# Altium schematic sheet 6_MUX.SchDoc
size A4; DocumentNumber: 5; SheetNumber: 6; SheetTotal: 6
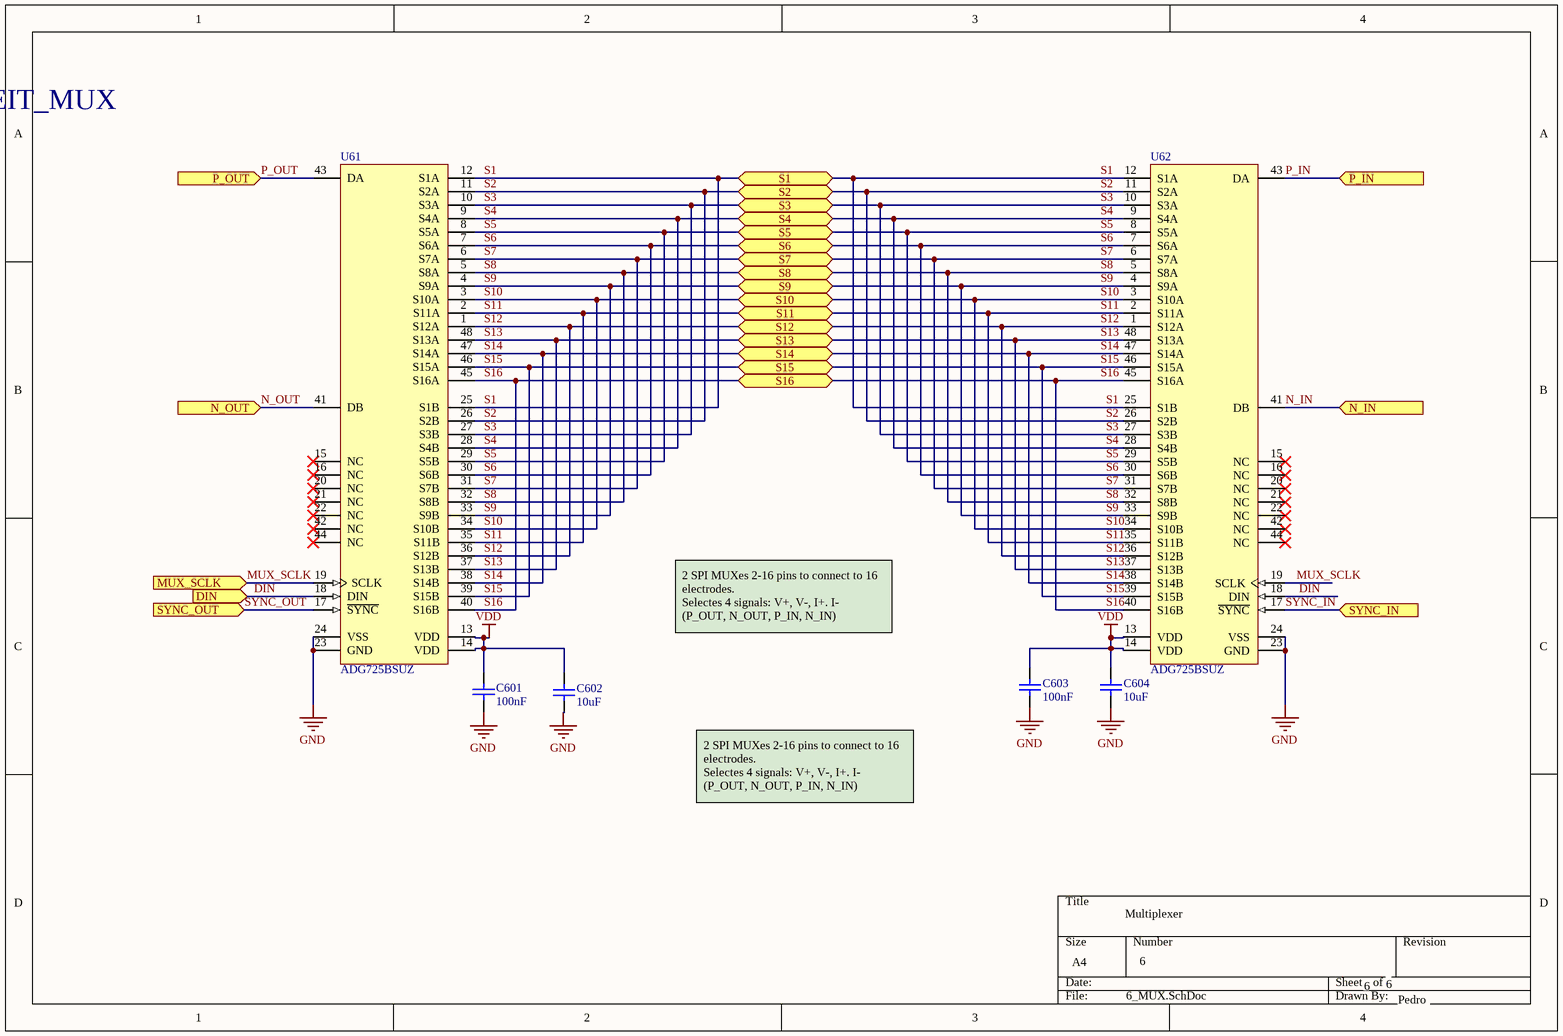
[diagram p0: 6_MUX.SchDoc]

## Parts
C601  value 100nF  [CAPC1005X55X30LL05T10]  (hidden comment: generic)
C602  value 10uF  [FP-C0603C-CF-IPC_A]  (hidden comment: generic)
C603  value 100nF  [CAPC1005X55X30LL05T10]  (hidden comment: generic)
C604  value 10uF  [FP-C0603C-CF-IPC_A]  (hidden comment: generic)
U61  ADG725BSUZ  [ADI-SU-48_N]
U62  ADG725BSUZ  [ADI-SU-48_N]

## Ports
DIN (in, see 1_RPi[3C]), MUX_SCLK (in, see 1_RPi[3C]), N_IN (in, see 1_RPi[3C]), N_OUT (in, see 1_RPi[2C]), P_IN (in, see 1_RPi[3C]), P_OUT (in, see 1_RPi[2C]), S1 (bidir, see 1_RPi[2C]), S2 (bidir, see 1_RPi[2C]), S3 (bidir, see 1_RPi[2C]), S4 (bidir, see 1_RPi[2C]), S5 (bidir, see 1_RPi[2C]), S6 (bidir, see 1_RPi[2C]), S7 (bidir, see 1_RPi[3C]), S8 (bidir, see 1_RPi[3C]), S9 (bidir, see 1_RPi[3C]), S10 (bidir, see 1_RPi[3C]), S11 (bidir, see 1_RPi[3C]), S12 (bidir, see 1_RPi[3C]), S13 (bidir, see 1_RPi[3C]), S14 (bidir, see 1_RPi[3C]), S15 (bidir, see 1_RPi[3C]), S16 (bidir, see 1_RPi[3C]), SYNC_IN (in, see 1_RPi[3C]), SYNC_OUT (in, see 1_RPi[2C])

## Nets
GND: C601.2 C602.2 C603.2 C604.2 U61.23(GND) U61.24(VSS) U62.23(GND) U62.24(VSS)
VDD: C601.1 C602.1 C603.1 C604.1 U61.13(VDD) U61.14(VDD) U62.13(VDD) U62.14(VDD)
DIN: U61.18(DIN) U62.18(DIN) ; port DIN
MUX_SCLK: U61.19(SCLK) U62.19(SCLK) ; port MUX_SCLK
N_IN: U62.41(DB) ; port N_IN
N_OUT: U61.41(DB) ; port N_OUT
P_IN: U62.43(DA) ; port P_IN
P_OUT: U61.43(DA) ; port P_OUT
S1: U61.12(S1A) U61.25(S1B) U62.12(S1A) U62.25(S1B) ; port S1
S2: U61.11(S2A) U61.26(S2B) U62.11(S2A) U62.26(S2B) ; port S2
S3: U61.10(S3A) U61.27(S3B) U62.10(S3A) U62.27(S3B) ; port S3
S4: U61.9(S4A) U61.28(S4B) U62.9(S4A) U62.28(S4B) ; port S4
S5: U61.8(S5A) U61.29(S5B) U62.8(S5A) U62.29(S5B) ; port S5
S6: U61.7(S6A) U61.30(S6B) U62.7(S6A) U62.30(S6B) ; port S6
S7: U61.6(S7A) U61.31(S7B) U62.6(S7A) U62.31(S7B) ; port S7
S8: U61.5(S8A) U61.32(S8B) U62.5(S8A) U62.32(S8B) ; port S8
S9: U61.4(S9A) U61.33(S9B) U62.4(S9A) U62.33(S9B) ; port S9
S10: U61.3(S10A) U61.34(S10B) U62.3(S10A) U62.34(S10B) ; port S10
S11: U61.2(S11A) U61.35(S11B) U62.2(S11A) U62.35(S11B) ; port S11
S12: U61.1(S12A) U61.36(S12B) U62.1(S12A) U62.36(S12B) ; port S12
S13: U61.37(S13B) U61.48(S13A) U62.37(S13B) U62.48(S13A) ; port S13
S14: U61.38(S14B) U61.47(S14A) U62.38(S14B) U62.47(S14A) ; port S14
S15: U61.39(S15B) U61.46(S15A) U62.39(S15B) U62.46(S15A) ; port S15
S16: U61.40(S16B) U61.45(S16A) U62.40(S16B) U62.45(S16A) ; port S16
SYNC_IN: U62.17(~{SYNC}) ; port SYNC_IN
SYNC_OUT: U61.17(~{SYNC}) ; port SYNC_OUT

Not connected (* = marked no-connect by the designer): U61 15(NC)* 16(NC)* 20(NC)* 21(NC)* 22(NC)* 42(NC)* 44(NC)*; U62 15(NC)* 16(NC)* 20(NC)* 21(NC)* 22(NC)* 42(NC)* 44(NC)*

## Notes on the sheet
- [6] 6_EIT_MUX
- 2 SPI MUXes 2-16 pins to connect to 16 electrodes.
  Selectes 4 signals: V+, V-, I+. I-
  (P_OUT, N_OUT, P_IN, N_IN)
- Multiplexer
- 6
- Pedro

## Library data of the parts
C601-C604 = Capacitor: Device Class L1: Passive Components; Device Class L2: Capacitors
U61 U62 = ADI-ADG725-SU-48: 1.8 to 5.5 V / +/-2.5 V, 4 Ohm, Serially Controlled, 16-Channel Analog Multiplexer, -40 to 85 degC, 48-pin QFP (SU-48), Tray; Manufacturer: Analog Devices; Supply V Guar Performance: Dual_(+/-2.5V), Single_(+3V), Single_(+5V); Max Analog Signal Range: Vss to Vdd; Ron (ohms): 4; t transition (s): 42n; Bandwidth (Hz): 34M; ComponentLink3Description: Package Specification; PackageDescription: 48-Pin Thin Plastic Quad Flat Package, Body 7 x 7 mm, Pitch 0.5 mm; ComponentLink2Description: Datasheet; ComponentLink2URL: http://www.analog.com/static/imported-files/data_sheets/ADG725_731.pdf; Packing: Tray; ComponentLink3URL: http://www.analog.com/static/imported-files/packages/470644706845302410119987SU48_7x7.pdf; PackageReference: SU-48; PartNumber: ADG725BSUZ; Code_JEDEC: MS-026ABC; DatasheetVersion: Rev. A; ComponentLink1Description: Manufacturer URL; ComponentLink1URL: http://www.analog.com/en/index.html; Mounting Technology: Surface Mount